# Altium schematic sheet usb_interface.SchDoc (part 3 of 3)
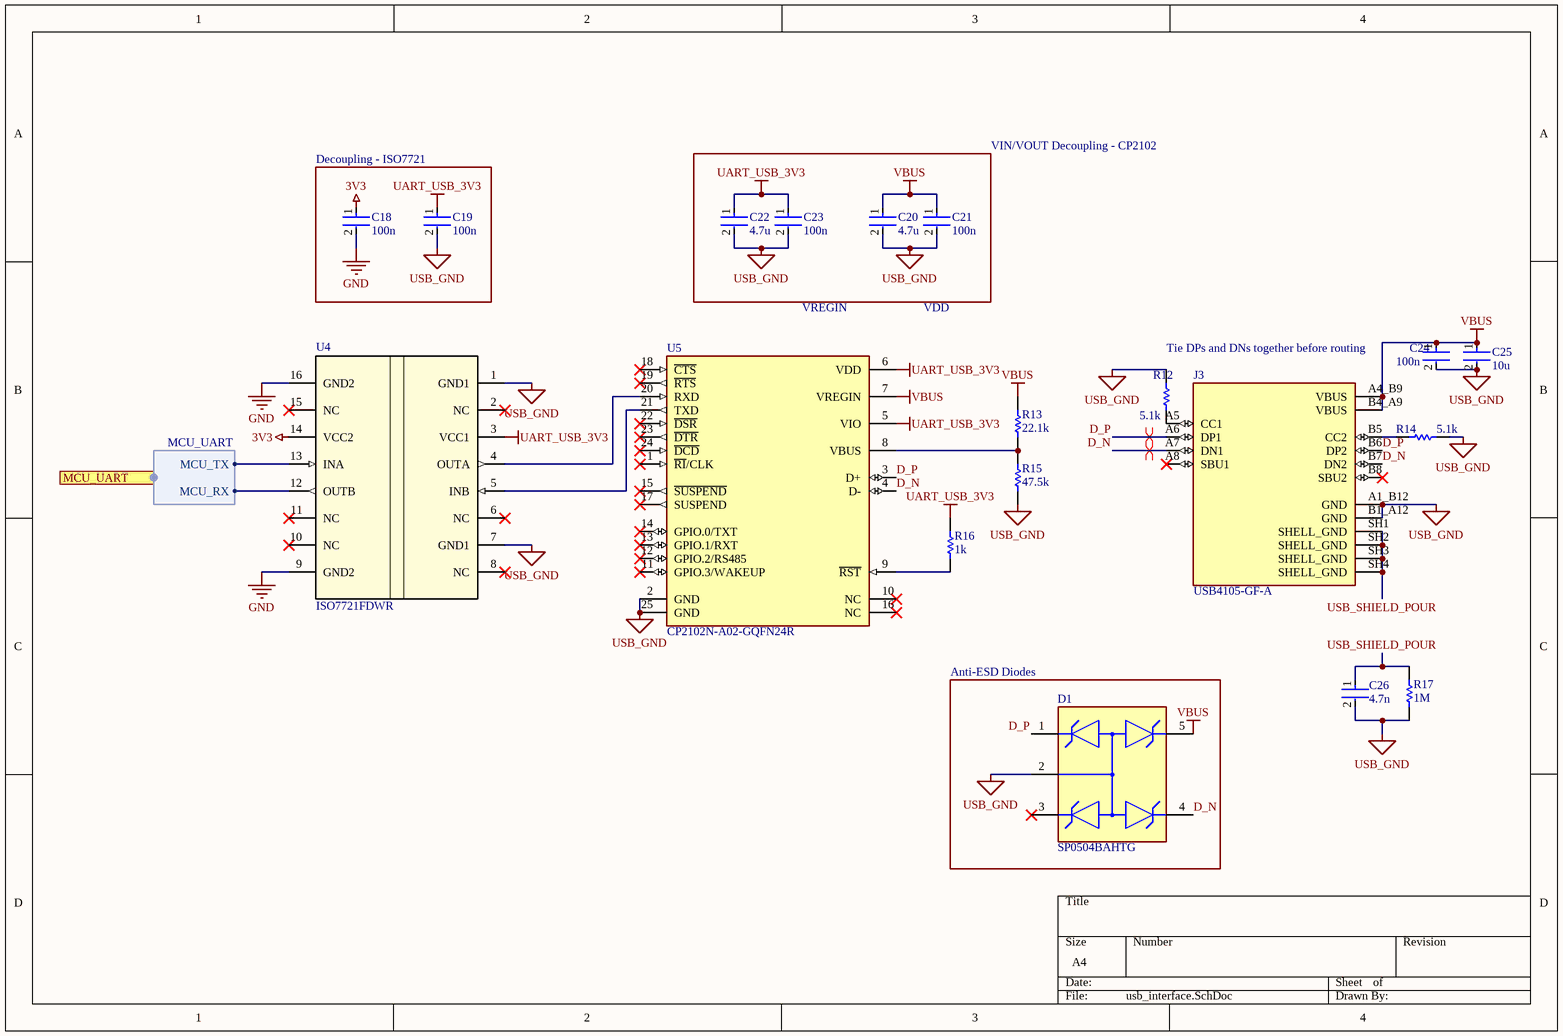
[diagram p2: usb_interface.SchDoc]

## Library data of the parts (continued)
R17 = RC0805FR-071ML: 125mW Thick Film Resistors 150V ±100ppm/℃ ±1% 1MΩ 0805 Chip Resistor - Surface Mount ROHS; Manufacturer: Yageo Group; Temperature Coefficient: 100ppm/°C; Supplier: DigiKey; Supplier Part Number: 311-1.00MCRCT-ND; Manufacturer Part Number: RC0805FR-071ML; RoHS: Compliant; Category: Chip SMD Resistors; Stock: 235812; Pricing: 1=0.1, 10=0.034, 25=0.0256, 50=0.0208, 100=0.0171, 250=0.01344, 500=0.01136, 1000=0.00973 (USD); Case/Package: 0805; Case Code (Imperial): 0805; China RoHS: Non-Compliant; Composition: Thick Film; Contact Plating: Tin; Country of Origin: Mainland China, Taiwan; Depth: 1.25mm; Export Control Classification Number (ECCN) Code: EAR99; Features: Moisture Resistant; Height: 500µm; Harmonized Tariff Schedule (HTS) Code: 8533.21.00.30; Introduction Date: 2004-09-22; Lead Free: Lead Free; Length: 2mm; Lifecycle Status: Production; Max Operating Temperature: 155°C; Max Power Dissipation: 125mW; Military Standard: Not; Min Operating Temperature: -55°C; Mounting Technology: Surface Mount; Pins: 2; Number of Terminals: 2; Number of Terminations: 2; Packaging: Tape & Reel; Power Rating: 125mW; Radiation Hardening: No; REACH SVHC: Yes; Value: 1MΩ; Schedule B: 8533210045, 8533210045|8533210045, 8533210045|8533210045|8533210045, 8533210045|8533210045|8533210045|8533210045; Termination: SMD/SMT; Tolerance: 1%; Voltage Rating: 150V; Voltage Rating (AC): 150V; Voltage Rating (DC): 150V; Width: 1.25mm; Working Voltage: 150V; ComponentLink1URL: https://datasheet.octopart.com:443/RC0805FR-071ML-Yageo-datasheet-175887523.pdf?src-supplier=IHS; ComponentLink1Description: https://datasheet.octopart.com:443/RC0805FR-071ML-Yageo-datasheet-175887523.pdf?src-supplier=IHS; ComponentLink2URL: https://datasheet.octopart.com:443/RC0805FR-071ML-Yageo-datasheet-103092701.pdf?src-supplier=Upverter; ComponentLink2Description: https://datasheet.octopart.com:443/RC0805FR-071ML-Yageo-datasheet-103092701.pdf?src-supplier=Upverter; ComponentLink3URL: https://datasheet.octopart.com:443/RC0805FR-071ML-Yageo-datasheet-79472498.pdf?src-supplier=Upverter; ComponentLink3Description: https://datasheet.octopart.com:443/RC0805FR-071ML-Yageo-datasheet-79472498.pdf?src-supplier=Upverter; ComponentLink4URL: https://datasheet.octopart.com:443/RC0805FR-071ML-Yageo-datasheet-8330313.pdf?src-supplier=element14+APAC; ComponentLink4Description: https://datasheet.octopart.com:443/RC0805FR-071ML-Yageo-datasheet-8330313.pdf?src-supplier=element14+APAC; ComponentLink5URL: https://datasheet.octopart.com:443/RC0805FR-071ML-Yageo-Group-datasheet-190305687.pdf?src-supplier=Future+Electronics; ComponentLink5Description: https://datasheet.octopart.com:443/RC0805FR-071ML-Yageo-Group-datasheet-190305687.pdf?src-supplier=Future+Electronics; ComponentLink6URL: https://datasheet.octopart.com:443/RC0805FR-071ML-Yageo-datasheet-164759695.pdf?src-supplier=Future+Electronics; ComponentLink6Description: https://datasheet.octopart.com:443/RC0805FR-071ML-Yageo-datasheet-164759695.pdf?src-supplier=Future+Electronics; ComponentLink7URL: https://datasheet.octopart.com:443/RC0805FR-071ML-Yageo-datasheet-127823281.pdf?src-supplier=Future+Electronics; ComponentLink7Description: https://datasheet.octopart.com:443/RC0805FR-071ML-Yageo-datasheet-127823281.pdf?src-supplier=Future+Electronics; ComponentLink8URL: https://datasheet.octopart.com:443/RC0805FR-071ML-Yageo-datasheet-137700087.pdf?src-supplier=Future+Electronics; ComponentLink8Description: https://datasheet.octopart.com:443/RC0805FR-071ML-Yageo-datasheet-137700087.pdf?src-supplier=Future+Electronics; ComponentLink9URL: https://datasheet.octopart.com:443/RC0805FR-071ML-Yageo-datasheet-12592811.pdf?src-supplier=Future+Electronics; ComponentLink9Description: https://datasheet.octopart.com:443/RC0805FR-071ML-Yageo-datasheet-12592811.pdf?src-supplier=Future+Electronics; ComponentLink10URL: https://datasheet.octopart.com:443/RC0805FR-071ML-Yageo-datasheet-8324252.pdf?src-supplier=Future+Electronics; ComponentLink10Description: https://datasheet.octopart.com:443/RC0805FR-071ML-Yageo-datasheet-8324252.pdf?src-supplier=Future+Electronics; ComponentLink11URL: https://datasheet.octopart.com:443/RC0805FR-071ML-Yageo-datasheet-62067350.pdf?src-supplier=Farnell; ComponentLink11Description: https://datasheet.octopart.com:443/RC0805FR-071ML-Yageo-datasheet-62067350.pdf?src-supplier=Farnell; ComponentLink12URL: https://datasheet.octopart.com:443/RC0805FR-071ML-Yageo-datasheet-13691069.pdf?src-supplier=Farnell; ComponentLink12Description: https://datasheet.octopart.com:443/RC0805FR-071ML-Yageo-datasheet-13691069.pdf?src-supplier=Farnell; ComponentLink13URL: https://datasheet.octopart.com/RC0805FR-071ML-Yageo-datasheet-73766026.pdf; ComponentLink13Description: https://datasheet.octopart.com/RC0805FR-071ML-Yageo-datasheet-73766026.pdf; ComponentLink14URL: https://datasheet.octopart.com:443/RC0805FR-071ML-Yageo-datasheet-118657.pdf?src-supplier=DigiKey; ComponentLink14Description: https://datasheet.octopart.com:443/RC0805FR-071ML-Yageo-datasheet-118657.pdf?src-supplier=DigiKey; ComponentLink15URL: https://datasheet.octopart.com:443/RC0805FR-071ML-Yageo-datasheet-502840.pdf?src-supplier=element14; ComponentLink15Description: https://datasheet.octopart.com:443/RC0805FR-071ML-Yageo-datasheet-502840.pdf?src-supplier=element14; ComponentLink16URL: http://sigma.octopart.com:80/conflict_mineral_statement/Yageo-company-3.pdf?src-supplier=Compliance+Statements; ComponentLink16Description: http://sigma.octopart.com:80/conflict_mineral_statement/Yageo-company-3.pdf?src-supplier=Compliance+Statements; ComponentLink17URL: http://sigma.octopart.com:80/rohs_statement/Yageo-company-2.pdf?src-supplier=Compliance+Statements; ComponentLink17Description: http://sigma.octopart.com:80/rohs_statement/Yageo-company-2.pdf?src-supplier=Compliance+Statements; Supplier 1: DigiKey; Supplier Part Number 1: 311-1.00MCRCT-ND
U4 = ISO7721FDWR: Robust EMC, dual-channel, 1/1, reinforced digital isolator 16-SOIC -55 to 125; Manufacturer: Texas Instruments; Manufacturer Lifecycle Status: ACTIVE; Number of Channels: 2; Supplier: DigiKey; Supplier Part Number: 296-50346-1-ND; Manufacturer Part Number: ISO7721FDWR; RoHS: Compliant; Category: Digital Isolators; Stock: 15127; Pricing: 1=2.81, 10=2.094, 25=1.9152, 100=1.719, 250=1.62544, 500=1.5912 (USD); Case/Package: SOIC; Height: 2.65mm; Length: 10.3mm; Lifecycle Status: Production; Max Operating Temperature: 125°C; Min Operating Temperature: -55°C; Pins: 16; Schedule B: 8542390000; Thickness: 2.35mm; Width: 7.5mm; ComponentLink1URL: https://sigma.octopart.com:443/99572200/technical_drawing/Texas-Instruments-ISO7721FDWR.pdf?src-supplier=Texas+Instruments; ComponentLink1Description: https://sigma.octopart.com:443/99572200/technical_drawing/Texas-Instruments-ISO7721FDWR.pdf?src-supplier=Texas+Instruments; ComponentLink2URL: https://octopart.com:443/opatz8j6/c1?t=WZGGJDtRhiNR6xegtZ0Vzw6Jo8gIA4OkeL83hLNHBc3xALLZrOPA1KnNx-ec0I_-l9PCMZWyk75e5H8g6RMrJLmMNblHietK_abbQyImjN_oP_YsooAsDmW-v19do6DZ4jzx_Fx10KWDm9m_aOouo5hdul-hNs1fyUCmYsyFAGwxgQVoL5HSj0hs2mmPUZ1tA5owilxFZB39lP5Z4zu9Z-zIWmlA_gcYXWOi0ejZsd6FGsUjnxzOjqnuUWppL6xj46YVsAzbwlJm8vaSz28l_1Pzc2Ovu0xt7ToOzTyA-3S1SSaUiJRJiBHsaq__PSD3_uPcVRWFFlJ45olTYWRTRE-pIoFVMvQ4rQZJrKrEDyxEsTd4Z0hpONkN6dpwLsYRK33xwkk&src-supplier=Texas+Instruments; ComponentLink2Description: https://octopart.com:443/opatz8j6/c1?t=WZGGJDtRhiNR6xegtZ0Vzw6Jo8gIA4OkeL83hLNHBc3xALLZrOPA1KnNx-ec0I_-l9PCMZWyk75e5H8g6RMrJLmMNblHietK_abbQyImjN_oP_YsooAsDmW-v19do6DZ4jzx_Fx10KWDm9m_aOouo5hdul-hNs1fyUCmYsyFAGwxgQVoL5HSj0hs2mmPUZ1tA5owilxFZB39lP5Z4zu9Z-zIWmlA_gcYXWOi0ejZsd6FGsUjnxzOjqnuUWppL6xj46YVsAzbwlJm8vaSz28l_1Pzc2Ovu0xt7ToOzTyA-3S1SSaUiJRJiBHsaq__PSD3_uPcVRWFFlJ45olTYWRTRE-pIoFVMvQ4rQZJrKrEDyxEsTd4Z0hpONkN6dpwLsYRK33xwkk&src-supplier=Texas+Instruments; ComponentLink3URL: https://sigma.octopart.com:443/49250197/technical_drawing/Texas-Instruments-ISO7721FDWR.pdf?src-supplier=Texas+Instruments; ComponentLink3Description: https://sigma.octopart.com:443/49250197/technical_drawing/Texas-Instruments-ISO7721FDWR.pdf?src-supplier=Texas+Instruments; ComponentLink4URL: https://datasheet.octopart.com:443/ISO7721FDWR-Texas-Instruments-datasheet-164414773.pdf?src-supplier=Augswan; ComponentLink4Description: https://datasheet.octopart.com:443/ISO7721FDWR-Texas-Instruments-datasheet-164414773.pdf?src-supplier=Augswan; ComponentLink5URL: https://datasheet.octopart.com:443/ISO7721FDWR-Texas-Instruments-datasheet-82513802.pdf?src-supplier=HQonline; ComponentLink5Description: https://datasheet.octopart.com:443/ISO7721FDWR-Texas-Instruments-datasheet-82513802.pdf?src-supplier=HQonline; ComponentLink6URL: http://sigma.octopart.com:80/reach_statement/Texas-Instruments-company-64.pdf?src-supplier=Compliance+Statements; ComponentLink6Description: http://sigma.octopart.com:80/reach_statement/Texas-Instruments-company-64.pdf?src-supplier=Compliance+Statements; ComponentLink7URL: http://sigma.octopart.com:80/conflict_mineral_statement/Texas-Instruments-company-63.pdf?src-supplier=Compliance+Statements; ComponentLink7Description: http://sigma.octopart.com:80/conflict_mineral_statement/Texas-Instruments-company-63.pdf?src-supplier=Compliance+Statements; Supplier 1: DigiKey; Supplier Part Number 1: 296-50346-1-ND
U5 = CP2102N-A02-GQFN24R: IC Usb to Uart Bridge QFN24 / Usb Bridge, Usb to Uart Usb 2.0 Uart Interface 24-QFN (4X4); Manufacturer: Silicon Lab; Manufacturer Lifecycle Status: FULL PRODUCTION; Data Rate: 1.5Mbps; Max Junction Temperature (Tj): 105°C; Max Supply Voltage: 3.6V; Min Supply Voltage: 3V; Nominal Supply Voltage (DC): 3.3V; Number of Digital IO: 4; Supplier: DigiKey; Supplier Part Number: 336-5888-1-ND; Manufacturer Part Number: CP2102N-A02-GQFN24R; RoHS: Compliant; Category: USB Interface ICs; Stock: 19089; Pricing: 1=4.89, 10=3.699, 25=3.402, 100=3.0755, 250=2.9198, 500=2.82596 (USD); Ambient Temperature Range High: 85°C; China RoHS: Compliant; Height: 800µm; Height - Seated (Max): 800µm; Harmonized Tariff Schedule (HTS) Code: 8542.31.00.30; Interface: UART; Introduction Date: 2019-03-12; Length: 4mm; Lifecycle Status: Production; Max Operating Temperature: 85°C; Min Operating Temperature: -40°C; Number of Terminals: 24; REACH SVHC: Yes; Schedule B: 8542390000, 8542390000|8542390000|8542390000|8542390000|8542390000; Temperature Grade: Industrial; Terminal Pitch: 500µm; Width: 4mm; ComponentLink1URL: https://datasheet.octopart.com:443/CP2102N-A02-GQFN24R-Silicon-Labs-datasheet-138898368.pdf?src-supplier=SHENGYU+ELECTRONICS; ComponentLink1Description: https://datasheet.octopart.com:443/CP2102N-A02-GQFN24R-Silicon-Labs-datasheet-138898368.pdf?src-supplier=SHENGYU+ELECTRONICS; ComponentLink2URL: https://datasheet.octopart.com:443/CP2102N-A02-GQFN24R-Silicon-Labs-datasheet-166051788.pdf?src-supplier=Burklin+Elektronik; ComponentLink2Description: https://datasheet.octopart.com:443/CP2102N-A02-GQFN24R-Silicon-Labs-datasheet-166051788.pdf?src-supplier=Burklin+Elektronik; Supplier 1: DigiKey; Supplier Part Number 1: 336-5888-1-ND